# Altium schematic sheet Load Cell Amplifier.SchDoc
size A4; SheetNumber: 2; SheetTotal: 5
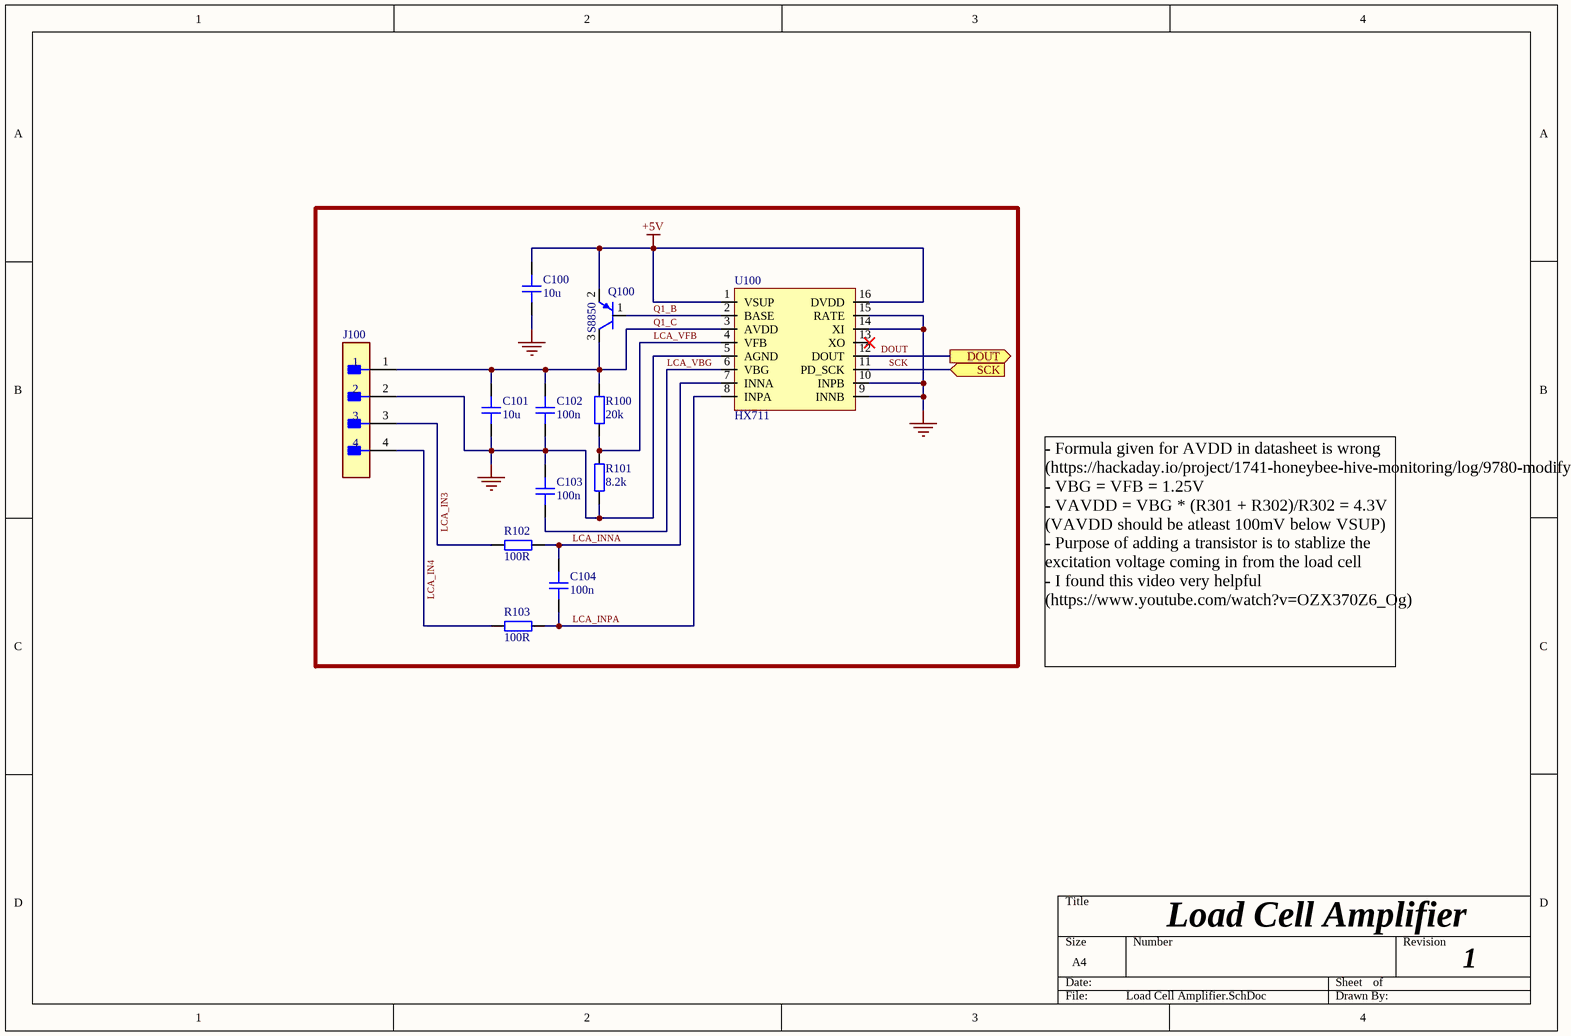
[diagram p0: Load Cell Amplifier.SchDoc]

## Parts
C100  10u  [CAP_0603]
C101  10u  [CAP_0603]
C102  100n  [CAP_0603]
C103  100n  [CAP_0603]
C104  100n  [CAP_0603]
J100  B4B-XH-A(LF)(SN)  [FP-B4B-XH-A_LF_SN-MFG]  (value not drawn)
Q100  S8850  [S8550]
R100  20k  [RES_0603]
R101  8.2k  [RES_0603]
R102  100R  [RES_0603]
R103  100R  [RES_0603]
U100  HX711  [HX711]

## Ports
DOUT (out, see Thrust Stand Controller Revised[3B]), SCK (in, see Thrust Stand Controller Revised[3B])

## Nets
+5V: C100.2 Q100.2 U100.1(VSUP) U100.16(DVDD)
GND: C100.1 C101.1 C102.1 C103.2 J100.2 R101.1 U100.5(AGND) U100.9(INNB) U100.10(INPB) U100.14(XI) U100.15(RATE)
DOUT: U100.12(DOUT) ; port DOUT
LCA_IN3: J100.3 R102.1
LCA_IN4: J100.4 R103.1
LCA_INNA: C104.2 R102.2 U100.7(INNA)
LCA_INPA: C104.1 R103.2 U100.8(INPA)
LCA_VBG: C103.1 U100.6(VBG)
LCA_VFB: R100.1 R101.2 U100.4(VFB)
Q1_B: Q100.1 U100.2(BASE)
Q1_C: C101.2 C102.2 J100.1 Q100.3 R100.2 U100.3(AVDD)
SCK: U100.11(PD_SCK) ; port SCK

Not connected (* = marked no-connect by the designer): U100 13(XO)*

## Notes on the sheet
- - Formula given for AVDD in datasheet is wrong (https://hackaday.io/project/1741-honeybee-hive-monitoring/log/9780-modifying-the-hx711-breakout-board-for-33v-operation)
  - VBG = VFB = 1.25V                                               - VAVDD = VBG * (R301 + R302)/R302 = 4.3V (VAVDD should be atleast 100mV below VSUP)
  - Purpose of adding a transistor is to stablize the excitation voltage coming in from the load cell
  - I found this video very helpful (https://www.youtube.com/watch?v=OZX370Z6_Og)
- Load Cell Amplifier
- 1

## Library data of the parts
C100-C104 = CAP_0603: Capacitor SMD 0603; Manufacturer: *; Manufacturer Part Number: *; Distributor Link: *; LCSC: *; Rating: *; Dielectric: *
J100 = CMP-17439-000250-1: CONN HEADER VERT 4POS 2.5MM; Number of Contacts: 4; Contact Resistance: 20mR; Voltage Rating: 250V; Max Current Rating: 3A; Gender: Male; Wire/Cable Gauge: 22AWG; Mated Stacking Heights: 9.8mm; Insulation Resistance: 1GR; Orientation: Straight; Contact Type: Male Pin; Contact Finish - Mating: TIN; Series: XH; Max Voltage Rating (AC): 250V; Lead Pitch: 2.5mm; Contact Shape: Square; Insulation Color: Natural; Termination: Solder; Lead Free: Lead Free; Voltage Rating (AC): 250V; Number of Rows: 1; Flammability Rating: UL94 V-0; Number of Positions: 4; Max Operating Temperature: 85°C; Package Quantity: 500; Mount: Through Hole; REACH SVHC: No SVHC; Connector Type: Header; Insulation Material: Nylon; Fastening Type: Detent; Min Operating Temperature: -25°C; Housing Color: White; Packaging: Bulk; Contact Plating: Tin; Contact Material: Brass; Max Voltage Rating (DC): 250V; Housing Material: Polyamide; Color: Natural; Material: Polyamide; Pitch: 2.5mm; Depth: 5.75mm; Current Rating: 3A; Length: 12.4mm
Q100 = S8850: 25V 300mW 500mA SOT-23 Bipolar (BJT) ROHS; Manufacturer: JSMSEMI; JLCPCB Part Number: C916391; Package: SOT-23; Assembly Type: SMD
R100-R103 = RES_0603: Resistor SMD 0603; Manufacturer: *; Manufacturer Part Number: *; Distributor Link: *; LCSC: *
U100 = HX711: Manufacturer: AVIA(海芯科技); Supplier: LCSC; Manufacturer Part: HX711; Supplier Part: C43656; JLCPCB Part Class: Extended Part; spicePre: U; spiceSymbolName: HX711